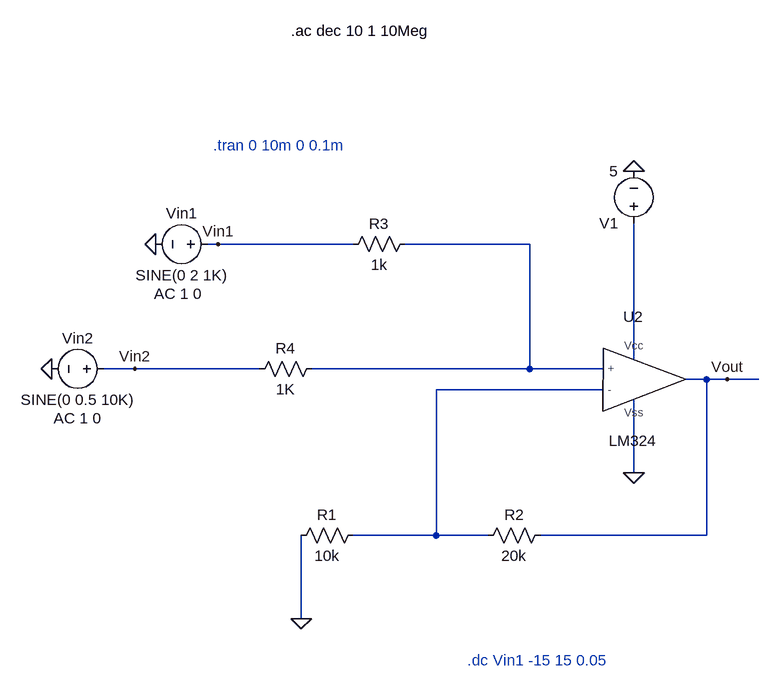
[diagram p0: schematic BAI 3 THUC HANH 1.asc]
BAI 3 THUC HANH 1.asc, the LTspice schematic file:
Version 4.1
SHEET 1 880 680
WIRE -256 -48 -272 -48
WIRE -48 -48 -256 -48
WIRE 224 -48 32 -48
WIRE 384 128 384 -80
WIRE -384 144 -432 144
WIRE -192 144 -384 144
WIRE 224 144 224 -48
WIRE 224 144 -112 144
WIRE 336 144 224 144
WIRE 496 160 464 160
WIRE 528 160 496 160
WIRE 576 160 528 160
WIRE 336 176 80 176
WIRE 384 304 384 192
WIRE 80 400 80 176
WIRE 80 400 -48 400
WIRE 160 400 80 400
WIRE 496 400 496 160
WIRE 496 400 240 400
WIRE -128 528 -128 400
FLAG 528 160 Vout
FLAG 384 -160 0
FLAG 384 304 0
FLAG -128 528 0
FLAG -256 -48 Vin1
FLAG -352 -48 0
FLAG -384 144 Vin2
FLAG -512 144 0
SYMBOL voltage 384 -64 R180
WINDOW 123 0 0 Left 0
WINDOW 39 0 0 Left 0
SYMATTR InstName V1
SYMATTR Value 5
SYMBOL res 256 384 R90
WINDOW 0 0 56 VBottom 2
WINDOW 3 32 56 VTop 2
SYMATTR InstName R2
SYMATTR Value 20k
SYMBOL res -32 384 R90
WINDOW 0 0 56 VBottom 2
WINDOW 3 32 56 VTop 2
SYMATTR InstName R1
SYMATTR Value 10k
SYMBOL res 48 -64 R90
WINDOW 0 0 56 VBottom 2
WINDOW 3 32 56 VTop 2
SYMATTR InstName R3
SYMATTR Value 1k
SYMBOL voltage -256 -48 R90
WINDOW 0 -32 56 VBottom 2
WINDOW 3 32 56 VTop 2
WINDOW 123 92 62 VBottom 2
WINDOW 39 0 0 Left 0
SYMATTR InstName Vin1
SYMATTR Value SINE(0 2 1K)
SYMATTR Value2 AC 1 0
SYMBOL res -96 128 R90
WINDOW 0 0 56 VBottom 2
WINDOW 3 32 56 VTop 2
SYMATTR InstName R4
SYMATTR Value 1K
SYMBOL voltage -416 144 R90
WINDOW 0 -32 56 VBottom 2
WINDOW 3 32 56 VTop 2
WINDOW 123 60 56 VTop 2
WINDOW 39 0 0 Left 0
SYMATTR InstName Vin2
SYMATTR Value SINE(0 0.5 10K)
SYMATTR Value2 AC 1 0
SYMBOL LM324 384 160 R0
SYMATTR InstName U2
TEXT -264 -200 Left 2 ;.tran 0 10m 0 0.1m
TEXT 128 592 Left 2 ;.dc Vin1 -15 15 0.05
TEXT -144 -376 Left 2 !.ac dec 10 1 10Meg

The netlist it stands for:
* BAI 3 THUC HANH 1.asc
V1 N002 0 5
R2 Vout N003 20k
R1 N003 0 10k
R3 N001 Vin1 1k
Vin1 Vin1 0 SINE(0 2 1K) AC 1 0
R4 N001 Vin2 1K
Vin2 Vin2 0 SINE(0 0.5 10K) AC 1 0
X§U2 N001 N003 N002 0 Vout LM324  ; pins + - Vcc Vss ?
* .tran 0 10m 0 0.1m
* .dc Vin1 -15 15 0.05
.ac dec 10 1 10Meg
.lib E:\ThiThucHanhCoHa\CoHa\LM324.cir
.backanno
.end